# EAGLE design DINCONTROLLER (EAGLE 9.0.0)
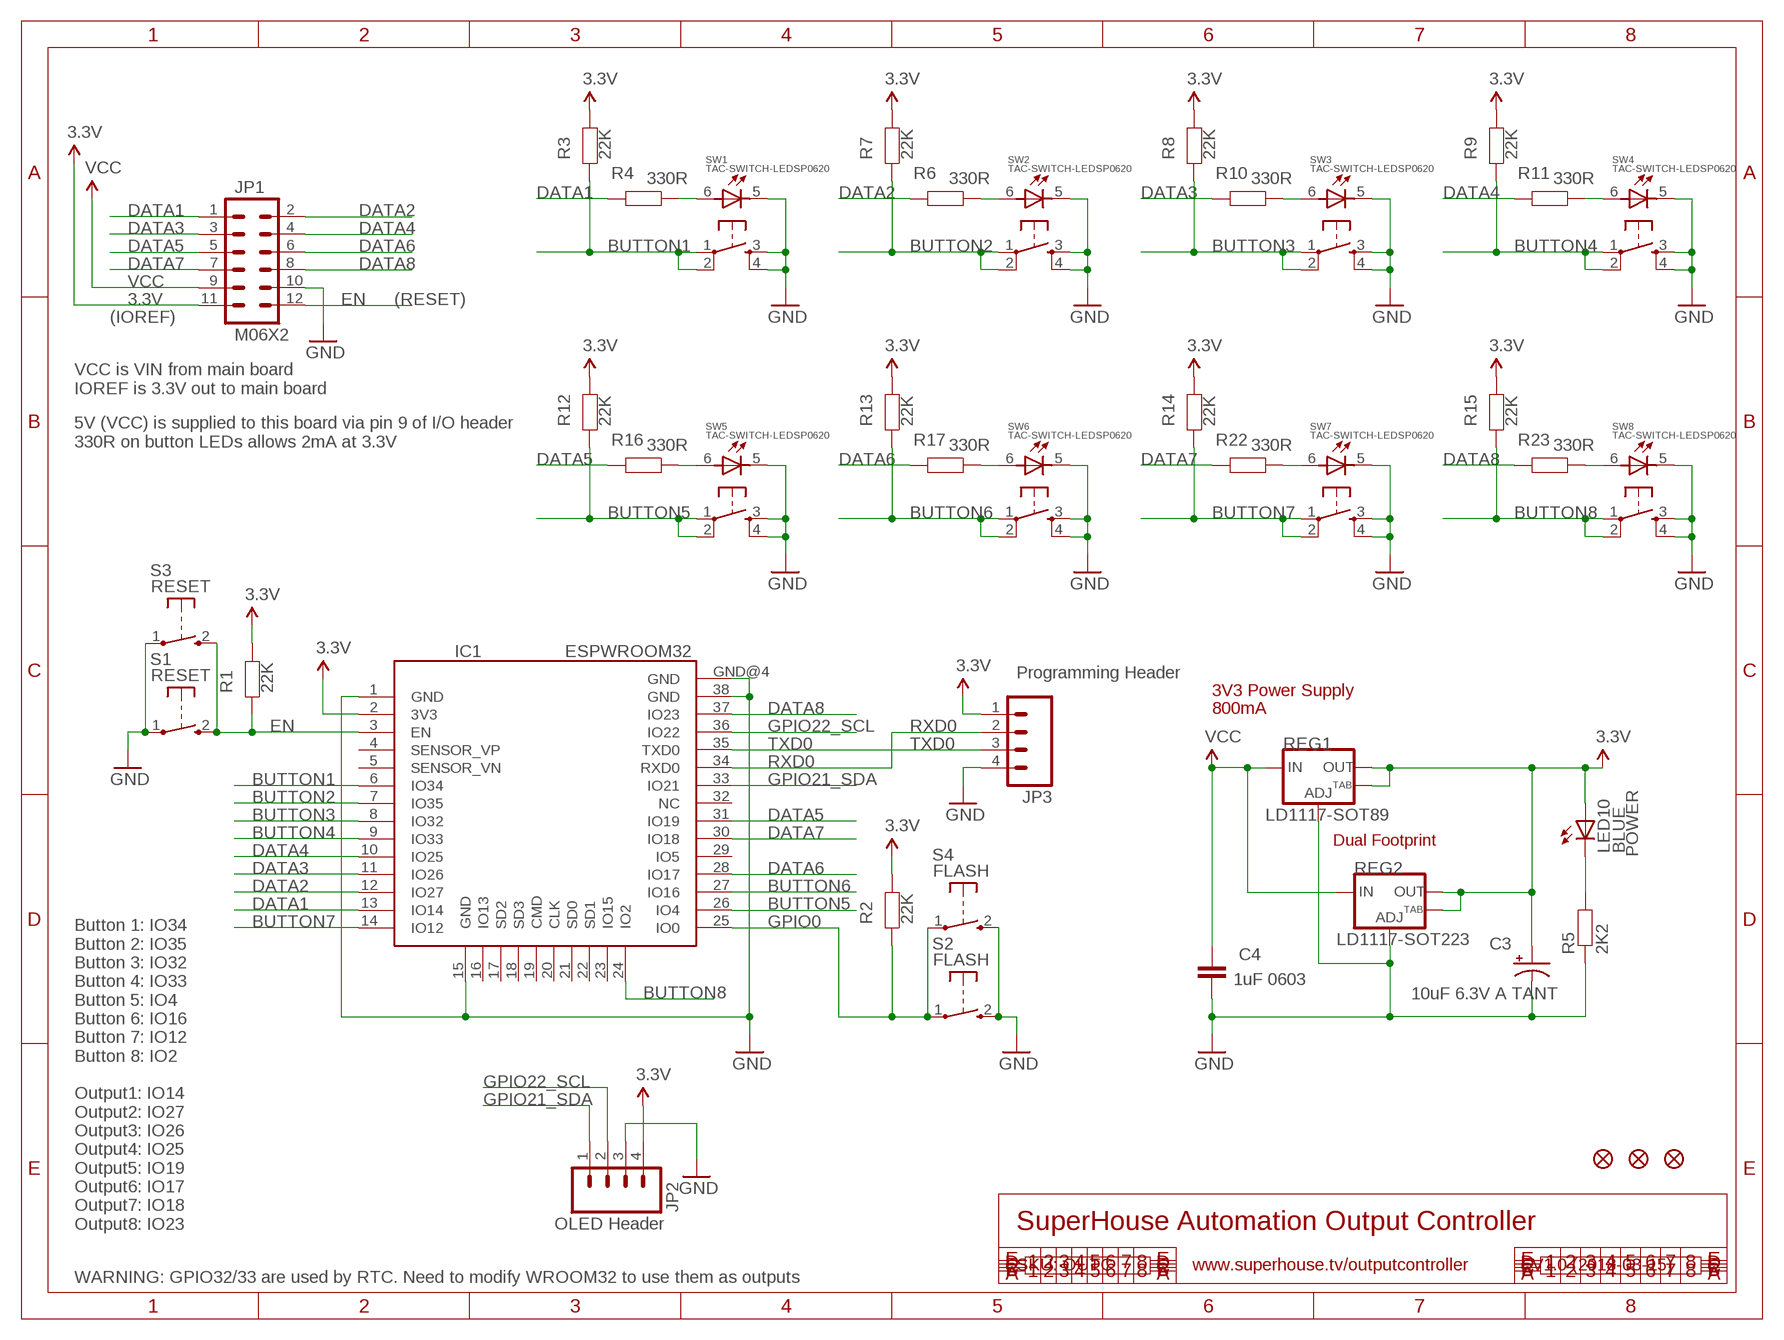
[diagram p0: schematic, sheet 1]

## Parts
C3  10uF 6.3V A TANT  CAP_POL1206  [EIA3216]
C4  1uF 0603  CAP0603  [0603]
FID1  FIDUCIAL1X2.5  [FIDUCIAL-1X2.5]
FID2  FIDUCIAL1X2.5  [FIDUCIAL-1X2.5]
FID3  FIDUCIAL1X2.5  [FIDUCIAL-1X2.5]
IC1  ESPWROOM32  [ESPWROOM32]
JP1  M06X2  [2X6-SHROUDED]
JP2  M04PTH  [1X04]
JP3  M04PTH  [1X04]
LED10  BLUE  LED3MM  [LED3MM]
R1  22K  RESISTOR0603  [0603@2]
R2  22K  RESISTOR0603  [0603@2]
R3  22K  RESISTOR0603  [0603@2]
R4  330R  RESISTOR0603  [0603@2]
R5  2K2  RESISTOR0603  [0603]
R6  330R  RESISTOR0603  [0603@2]
R7  22K  RESISTOR0603  [0603@2]
R8  22K  RESISTOR0603  [0603@2]
R9  22K  RESISTOR0603  [0603@2]
R10  330R  RESISTOR0603  [0603@2]
R11  330R  RESISTOR0603  [0603@2]
R12  22K  RESISTOR0603  [0603@2]
R13  22K  RESISTOR0603  [0603@2]
R14  22K  RESISTOR0603  [0603@2]
R15  22K  RESISTOR0603  [0603@2]
R16  330R  RESISTOR0603  [0603@2]
R17  330R  RESISTOR0603  [0603@2]
R22  330R  RESISTOR0603  [0603@2]
R23  330R  RESISTOR0603  [0603@2]
REG1  LD1117-SOT89  V_REG_LM1117SOT89  [SOT89]
REG2  LD1117-SOT223  V_REG_LM1117SOT223  [SOT223]
S1  RESET  TAC_SWITCH_2PINSMT  [TACTILE_SWITCH_SMD_2PIN_TINY]
S2  FLASH  TAC_SWITCH_2PINSMT  [TACTILE_SWITCH_SMD_2PIN_TINY]
S3  RESET  TAC_SWITCH_2PINSMT  [TACTILE_SWITCH_SMD_2PIN_TINY]
S4  FLASH  TAC_SWITCH_2PINSMT  [TACTILE_SWITCH_SMD_2PIN_TINY]
SW1  TAC-SWITCH-LEDSP0620  [TACTILE-PTH-SP0620]
SW2  TAC-SWITCH-LEDSP0620  [TACTILE-PTH-SP0620]
SW3  TAC-SWITCH-LEDSP0620  [TACTILE-PTH-SP0620]
SW4  TAC-SWITCH-LEDSP0620  [TACTILE-PTH-SP0620]
SW5  TAC-SWITCH-LEDSP0620  [TACTILE-PTH-SP0620]
SW6  TAC-SWITCH-LEDSP0620  [TACTILE-PTH-SP0620]
SW7  TAC-SWITCH-LEDSP0620  [TACTILE-PTH-SP0620]
SW8  TAC-SWITCH-LEDSP0620  [TACTILE-PTH-SP0620]

## Nets
3.3V: C3.A(+) IC1.2(3V3) JP1.11 JP2.4 JP3.1 LED10.A R1.1 R2.1 R3.1 R7.1 R8.1 R9.1 R12.1 R13.1 R14.1 R15.1 REG1.2(OUT) REG1.4(OUT) REG2.2(OUT) REG2.4(OUT)
BUTTON1: IC1.6(IO34) R3.2 SW1.1 SW1.2
BUTTON2: IC1.7(IO35) R7.2 SW2.1 SW2.2
BUTTON3: IC1.8(IO32) R8.2 SW3.1 SW3.2
BUTTON4: IC1.9(IO33) R9.2 SW4.1 SW4.2
BUTTON5: IC1.26(IO4) R12.2 SW5.1 SW5.2
BUTTON6: IC1.27(IO16) R13.2 SW6.1 SW6.2
BUTTON7: IC1.14(IO12) R14.2 SW7.1 SW7.2
BUTTON8: IC1.24(IO2) R15.2 SW8.1 SW8.2
DATA1: IC1.13(IO14) JP1.1 R4.2
DATA2: IC1.12(IO27) JP1.2 R6.2
DATA3: IC1.11(IO26) JP1.3 R10.2
DATA4: IC1.10(IO25) JP1.4 R11.2
DATA5: IC1.31(IO19) JP1.5 R16.2
DATA6: IC1.28(IO17) JP1.6 R17.2
DATA7: IC1.30(IO18) JP1.7 R22.2
DATA8: IC1.37(IO23) JP1.8 R23.2
EN: IC1.3(EN) JP1.12 R1.2 S1.2(S) S3.2(S)
GND: C3.C(-) C4.2 IC1.1(GND) IC1.15(GND) IC1.38(GND) IC1.GND@4(GND) JP1.10 JP2.3 JP3.4 R5.1 REG1.1(ADJ) REG2.1(ADJ) S1.1(P) S2.2(S) S3.1(P) S4.2(S) SW1.3 SW1.4 SW1.5(C) SW2.3 SW2.4 SW2.5(C) SW3.3 SW3.4 SW3.5(C) SW4.3 SW4.4 SW4.5(C) SW5.3 SW5.4 SW5.5(C) SW6.3 SW6.4 SW6.5(C) SW7.3 SW7.4 SW7.5(C) SW8.3 SW8.4 SW8.5(C)
GPIO0: IC1.25(IO0) R2.2 S2.1(P) S4.1(P)
GPIO21_SDA: IC1.33(IO21) JP2.1
GPIO22_SCL: IC1.36(IO22) JP2.2
N$1: R4.1 SW1.6(A)
N$2: R11.1 SW4.6(A)
N$6: R6.1 SW2.6(A)
N$13: R10.1 SW3.6(A)
N$14: LED10.K(C) R5.2
N$17: R16.1 SW5.6(A)
N$18: R17.1 SW6.6(A)
N$23: R22.1 SW7.6(A)
N$24: R23.1 SW8.6(A)
RXD0: IC1.34(RXD0) JP3.2
TXD0: IC1.35(TXD0) JP3.3
VCC: C4.1 JP1.9 REG1.3(IN) REG2.3(IN)
Unconnected: IC1.4(SENSOR_VP) IC1.5(SENSOR_VN) IC1.16(IO13) IC1.17(SD2) IC1.18(SD3) IC1.19(CMD) IC1.20(CLK) IC1.21(SD0) IC1.22(SD1) IC1.23(IO15) IC1.29(IO5) IC1.32(NC)

## Notes on the sheet
- (RESET)
- (IOREF)
- VCC is VIN from main board
  IOREF is 3.3V out to main board
- 5V (VCC) is supplied to this board via pin 9 of I/O header
  330R on button LEDs allows 2mA at 3.3V
- Programming Header
- 3V3 Power Supply
- 800mA
- Dual Footprint
- POWER
- Button 1: IO34
  Button 2: IO35
  Button 3: IO32
  Button 4: IO33
  Button 5: IO4
  Button 6: IO16
  Button 7: IO12
  Button 8: IO2
  
  Output1: IO14
  Output2: IO27
  Output3: IO26
  Output4: IO25
  Output5: IO19
  Output6: IO17
  Output7: IO18
  Output8: IO23
- OLED Header | SuperHouse Automation Output Controller
- SKU: OUTC | www.superhouse.tv/outputcontroller | V1.0 (2018-03-15)
- WARNING: GPIO32/33 are used by RTC. Need to modify WROOM32 to use them as outputs

## Library data of the parts
C3 = freetronics:CAP_POL: Capacitor Polarized These are standard SMD and PTH capacitors. Normally 10uF, 47uF, and 100uF in electrolytic and tantalum varieties. Always verify the external diameter of the through hole cap, it varies with capacity, voltage, and manufacturer. The EIA devices should be standard.
C4 = freetronics:CAP: Capacitor Standard 0603 ceramic capacitor, and 0.1" leaded capacitor.
FID1-FID3 = freetronics:FIDUCIAL: Fiducial Alignment Points Various fiducial points for machine vision alignment.
IC1 = freetronics-jon:ESPWROOM32
JP1 = freetronics-jon:M06X2
JP2 JP3 = freetronics-jon:M04: Header 4 Standard 4-pin 0.1" header. Use with straight break away headers (SKU : PRT-00116), right angle break away headers (PRT-00553), swiss pins (PRT-00743), machine pins (PRT-00117), and female headers (PRT-00115). Molex polarized connector foot print use with SKU : PRT-08231 with associated crimp pins and housings. 1MM SMD Version SKU: PRT-10208
LED10 = freetronics-jon:LED: LEDs Standard schematic elements and footprints for 5mm, 3mm, 1206, and 0603 sized LEDs. 5mm - Spark Fun Electronics SKU : COM-00529 (and others)
R1-R4 R6-R17 R22 R23 = freetronics:RESISTOR: Resistor Basic schematic elements and footprints for 0603, 1206, and PTH 1/10th watt (small) resistors.
R5 = freetronics-jon:RESISTOR: Resistor Basic schematic elements and footprints for 0603, 1206, and PTH 1/10th watt (small) resistors.
REG1 REG2 = freetronics:V_REG_LM1117: Voltage Regulator LD1117 Adjustable low-dropout voltage regulator available in SOT89 and SOT223 SMT packages.
S1-S4 = freetronics-jon:TAC_SWITCH_2PIN: Momentary Tactile Switch - 2 pin
SW1-SW8 = freetronics-jon:TAC-SWITCH-LED: Tactile button with LED illumination

## Net classes
0 Default: width 0.203 mm
1 VCC: width 0.305 mm

## Board
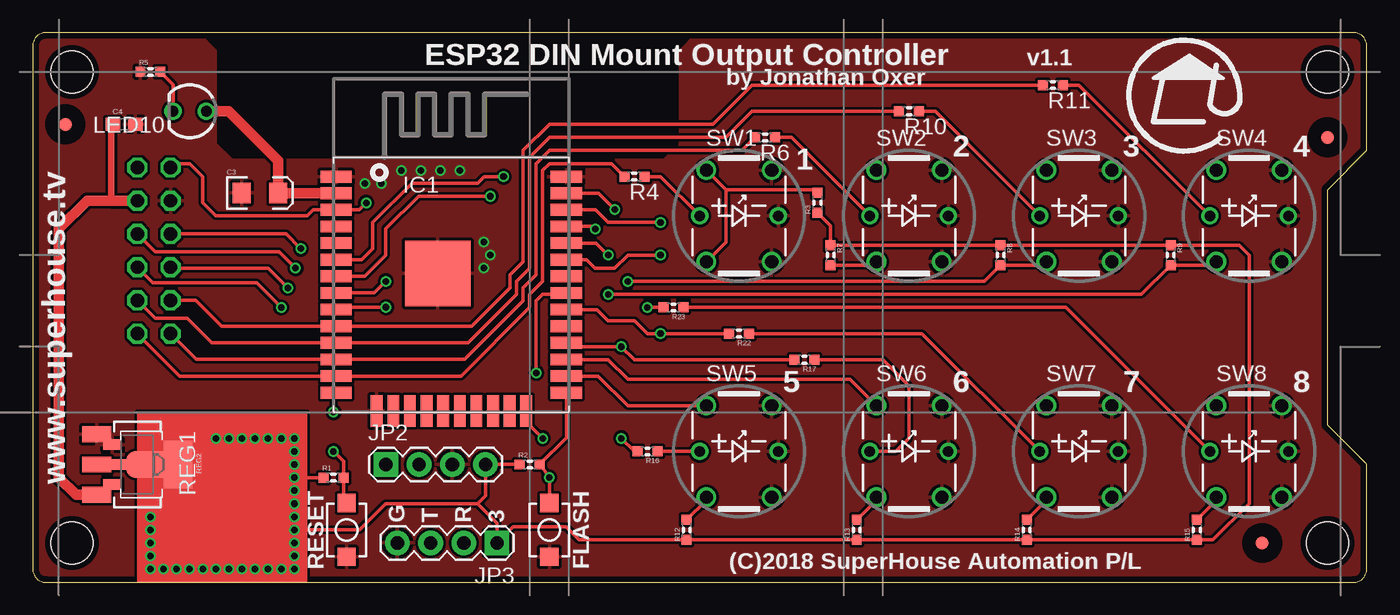
[diagram p1: board, top side]
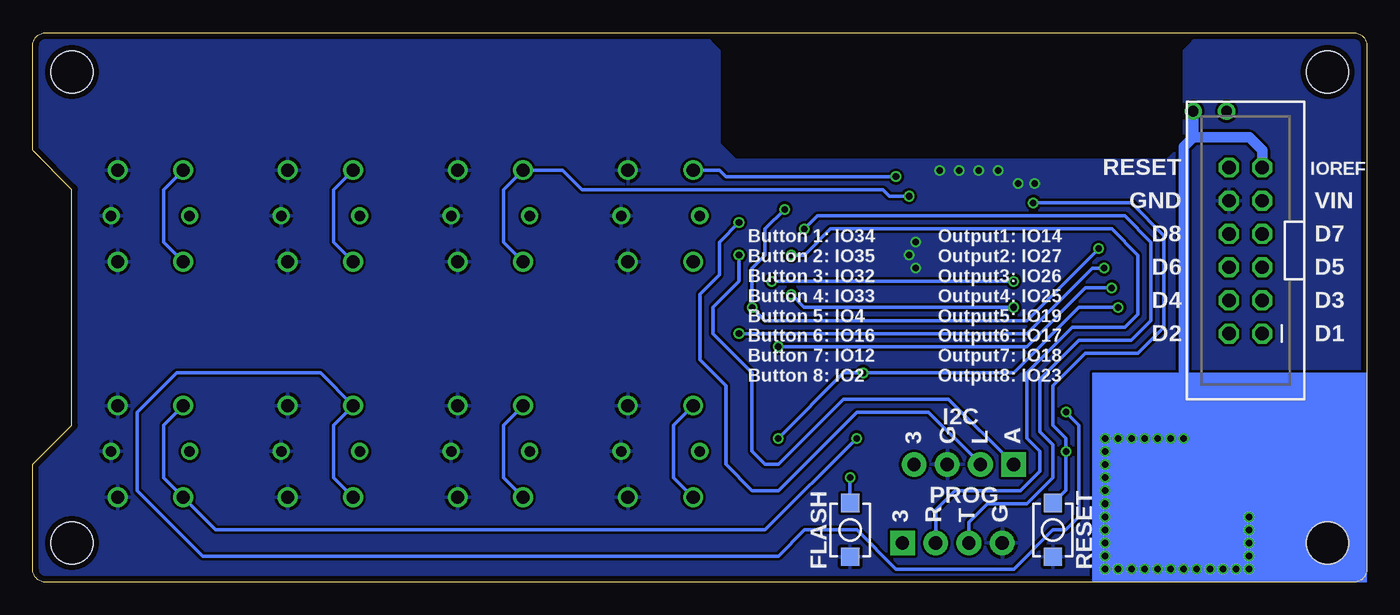
[diagram p2: board, bottom side, seen from below]

Size 102 x 42 mm. Coordinates in mm from the lower left corner, seen from the top.
Outline: 101,42 1,42 arc90 0,41 0,1 arc90 1,0 101,0 arc90 102,1 102,9 99,12 99,30 102,33 102,41 arc90 101,42
Copper layers (1*16): Top 0.035mm / dielectric 1.5mm / Bottom 0.035mm
Design rules "default": minimum track width 8mil, minimum drill 15mil, track to track 8mil, track to pad 8mil, pad to pad 8mil, via to via 8mil, smd to smd 8mil, copper to edge 18mil, drill to drill 8mil, minimum pad ring 10mil, minimum via ring 6mil, stop-mask expansion 4mil, vias tented up to drill 25mil, thermal gap 10mil
Holes 3.2 mm at 3,3 3,39 99,3 99,39
tRestrict: area 93,2 to 95,4; area 1.5,34 to 3.5,36; area 98,33 to 100,35

### Footprints (pad centres in the part's own frame; a part is rotated, then mirrored left to right if it is on the bottom)
EIA3216 = smd 1.4 x 1.6: A 1.4,0; C -1.4,0
0603 = smd 1.1 x 1: 1 -0.85,0; 2 0.85,0
FIDUCIAL-1X2.5 = smd 1 x 1: 1 0,0
ESPWROOM32 = smd 2.4 x 0.9: 1 -8.8,-1.5; 2 -8.8,-2.77; 3 -8.8,-4.04; 4 -8.8,-5.31; 5 -8.8,-6.58; 6 -8.8,-7.85; 7 -8.8,-9.12; 8 -8.8,-10.39; 9 -8.8,-11.66; 10 -8.8,-12.93; 11 -8.8,-14.2; 12 -8.8,-15.47; 13 -8.8,-16.74; 14 -8.8,-18.01; 25 8.8,-18.01; 26 8.8,-16.74; 27 8.8,-15.47; 28 8.8,-14.2; 29 8.8,-12.93; 30 8.8,-11.66; 31 8.8,-10.39; 32 8.8,-9.12; 33 8.8,-7.85; 34 8.8,-6.58; 35 8.8,-5.31; 36 8.8,-4.04; 37 8.8,-2.77; 38 8.8,-1.5 | smd 0.9 x 2.4: 15 -5.7,-19.4; 16 -4.43,-19.4; 17 -3.16,-19.4; 18 -1.89,-19.4; 19 -0.62,-19.4; 20 0.65,-19.4; 21 1.92,-19.4; 22 3.19,-19.4; 23 4.46,-19.4; 24 5.73,-19.4 | smd 5 x 5: GND@4 -1.03,-8.89
2X6-SHROUDED = drill 1.016 octagon: 1 0,0; 2 2.54,0; 3 0,-2.54; 4 2.54,-2.54; 5 0,-5.08; 6 2.54,-5.08; 7 0,-7.62; 8 2.54,-7.62; 9 0,-10.16; 10 2.54,-10.16; 11 0,-12.7; 12 2.54,-12.7
1X04 = drill 1.016 pad 1.88 square: 1 0,0 | drill 1.016 pad 1.88: 2 2.54,0; 3 5.08,0; 4 7.62,0
LED3MM = drill 0.813: A -1.27,0; K 1.27,0
0603@2 = smd 0.762 x 0.762: 1 -0.762,0; 2 0.762,0
0603' = smd 0.762 x 0.762: 1 -0.762,0; 2 0.762,0
SOT89 = smd 0.8 x 1.4: 1 -1.524,-1.905; 3 1.524,-1.905 | smd 0.8 x 1.9: 2 0,-1.651 | smd 2.032 x 3.65: 4 0,0.94
SOT223 = smd 1.219 x 2.235: 1 -2.311,-3.099; 2 0,-3.099; 3 2.311,-3.099 | smd 3.6 x 2.2: 4 0,3.099
TACTILE_SWITCH_SMD_2PIN_TINY = smd 1.4 x 1.4: 1 -2.05,0; 2 2.05,0
TACTILE-PTH-SP0620 = drill 1: 1 -2.5,-3.5; 2 -2.5,3.5; 3 2.5,-3.5; 4 2.5,3.5 | drill 0.8: 5 3,0; 6 -3,0

### Placement (x,y rotation side)
C3  17.37,29.75 0 top
C4  7,35 0 top
FID1  94,3 180 top
FID2  2.5,35 180 top
FID3  99,34 180 top
IC1  32,32.5 0 top
JP1  8,19 180 bottom
JP2  27,9 0 top
JP3  35.5,3 180 top
LED10  12,36 180 top
R1  23,8 0 top
R2  38,9 0 top
R3  60,29 90 top
R4  46,31 180 top
R5  2K2  [0603']  9,39 0 top
R6  56,34 180 top
R7  61,25 270 top
R8  74,25 270 top
R9  87,25 270 top
R10  67,36 180 top
R11  78,38 180 top
R12  50,4 90 top
R13  63,4 90 top
R14  76,4 90 top
R15  89,4 90 top
R16  47,10 180 top
R17  59,17 180 top
R22  54,19 180 top
R23  49,21 180 top
REG1  8,9 270 top
REG2  8,9 270 top
S1  24,4 90 top
S2  39.5,4 270 top
S3  24,4 90 bottom
S4  39.5,4 270 bottom
SW1  54,28 0 top
SW2  67,28 0 top
SW3  80,28 0 top
SW4  93,28 0 top
SW5  54,10 0 top
SW6  67,10 0 top
SW7  80,10 0 top
SW8  93,10 0 top

### Tracks (layer width: path | path; a pad name or v marks a point on that pad's centre or on a via)
3.3V  (via drill 0.5)
  Top 0.254: v20,2 20.33,2 | v20,2 18.1,2 REG2.4 | v14,11 13.1,11 REG2.4 | REG2.2 REG1.2 REG1.4 REG2.4 | v19,11 18,10 | v9,1 v10,1 v11,1 | v20,6 v20,5 | v19,1 v20,2 | v15,1 v16,1 | R1.1 v20,8 | R3.1 61,27.24 R7.1 R8.1 R9.1 92.24,25.76 93,25 93,6 90.24,3.24 R15.1 R14.1 R13.1 R12.1 41.76,3.24 40.76,4.24 36.74,4.24 JP3.1 35.5,4.5 34,6 | R2.1 JP2.4 34.62,6.62 34,6 | 34,6 27,6 25,4 v20,4
  Top 0.508: v14,11 v15,11 v16,11 v17,11 v18,11 v19,11 v20,11 | v9,1 v9,2 v9,3 | v9,3 v9,4 v9,5 v9,3 | v11,1 v12,1 v13,1 | v13,1 v14,1 v15,1 v13,1 | v16,1 v17,1 v18,1 v19,1 v20,1 | v20,2 v20,3 v20,4 v20,5 | v20,6 v20,7 v20,8 | v20,8 v20,9 v20,10 v20,8
  Top 0.813: LED10.A 15,36 18.77,32.23 C3.A 19.09,29.43 19.39,29.73 IC1.2
  Bottom 0.813: JP1.11 8,33 9,34 13.27,34 | 13.27,34 LED10.A | 13.27,34 14,33.27 v14,11
BUTTON1  (via drill 0.5)
  Top 0.254: IC1.6 25.15,24.65 26,25.5 26,27.5 29,30.5 34,30.5 34.5,31 v36,31 | SW1.2 53,30 | 53,30 53,26 SW1.1 | R3.2 59.76,30 53,30
  Bottom 0.254: SW1.2 49.5,31.5 49,31 v36,31
BUTTON2  (via drill 0.5)
  Top 0.254: IC1.7 25.38,23.38 27,25 27,27 29.5,29.5 v35,29.5 | R7.2 64.24,24.24 SW2.1
  Bottom 0.254: SW2.1 66,26 66,30 SW2.2 61.5,31.5 60,30 37,30 36.5,29.5 v35,29.5
BUTTON3  (via drill 0.5)
  Top 0.254: IC1.8 26.11,22.11 v27,23 | R8.2 72.76,23 v45.5,23 | 74.06,24.3 R8.2 | R8.2 77.24,24.24 SW3.1
  Bottom 0.254: SW3.1 79,26 79,30 SW3.2 | v45.5,23 v27,23
BUTTON4  (via drill 0.5)
  Top 0.254: IC1.9 23.36,21 27,21 v27.02,21.02 | v44,22 84.76,22 R9.2 90.24,24.24 SW4.1
  Bottom 0.254: SW4.1 92,26 92,30 SW4.2 | v27.02,21.02 42.98,21.02 | 42.98,21.02 43,21 | v44,22 43.02,21.02 42.98,21.02
BUTTON5
  Top 0.254: R12.2 51.5,6.26 SW5.1 | SW5.2 45.5,13.5 43.24,15.76 IC1.26
  Bottom 0.254: SW5.1 53,8 53,12 SW5.2
BUTTON6
  Top 0.254: IC1.27 40.83,17 44,17 45.5,15.5 62.5,15.5 SW6.2 | R13.2 64.5,6.26 SW6.1
  Bottom 0.254: SW6.1 66,8 66,12 SW6.2
BUTTON7  (via drill 0.5)
  Top 0.254: R14.2 77.5,6.26 SW7.1 | IC1.14 23,14.29 v23,13
  Bottom 0.254: SW7.1 79,8 79,12 SW7.2 80,16 91,16 94,13 94,7 89,2 45,2 43,4 39,4 36,1 27,1 24,4 23,4 22,5 22,12 v23,13
BUTTON8  (via drill 0.5)
  Top 0.254: R15.2 90.5,6.26 SW8.1 | v39,11 37.73,12.27 IC1.24
  Bottom 0.254: SW8.2 92,12 92,8 SW8.1 88,4 46,4 v39,11
DATA1
  Top 0.254: R4.2 44.24,32 39.5,32 39,31.5 39,23 38,22 38,21 32.76,15.76 IC1.13 11.24,15.76 JP1.1
DATA2
  Top 0.254: JP1.2 12.51,17.03 IC1.12 33.03,17.03 37.5,21.5 37.5,22.5 38.5,23.5 38.5,32 39.5,33 54.24,33 R6.2
DATA3
  Top 0.254: JP1.3 9.35,20.19 11.81,20.19 13.7,18.3 IC1.11 33.3,18.3 37,22 37,23 38,24 38,32.5 39.5,34 53,34 55,36 R10.2
DATA4
  Top 0.254: JP1.4 12.46,21.54 14.43,19.57 IC1.10 33.57,19.57 36.5,22.5 36.5,23.5 37.5,24.5 37.5,33 39.5,35 52,35 55,38 R11.2
DATA5  (via drill 0.5)
  Top 0.254: JP1.5 9.19,22.89 11,22.89 11.39,22.89 17.11,22.89 v19,21 | 40.91,22 IC1.31 40.69,22 39,22 38.5,21.5 v38.5,16 | v45,11 46,10 R16.2
  Bottom 0.254: v19,21 22,21 27,16 v38.5,16 40,16 v45,11
DATA6  (via drill 0.5)
  Top 0.254: JP1.6 10.62,24 18,24 v19.5,22.5 | R17.2 46,17 v45,18 41.1,18 IC1.28
  Bottom 0.254: v19.5,22.5 21.5,22.5 26,18 v45,18
DATA7  (via drill 0.5)
  Top 0.254: JP1.7 9.35,25.27 18.83,25.27 v20.1,24 | R22.2 v48,19 47,19 46,20 44,20 43.16,20.84 IC1.30
  Bottom 0.254: v20.1,24 21,24 26,19 v48,19
DATA8  (via drill 0.5)
  Top 0.254: v47,21 R23.2 | v20.5,25.5 19.38,26.62 JP1.8 | v44.5,28.5 43.27,29.73 IC1.37
  Bottom 0.254: v20.5,25.5 26,20 46,20 v47,21 47,24 46,25 46,27 v44.5,28.5
EN  (via drill 0.5)
  Top 0.254: S3.2 23.76,6.29 R1.2 23.76,9.24 v23,10 | v25.5,29 24.96,28.46 IC1.3 21.46,28.46 21,28 14,28 13,29 13,31 12,32 10.84,32 JP1.12
  Bottom 0.254: v25.5,29 18,29 15.5,26.5 15.5,19.5 17.5,17.5 21.5,17.5 24,15 24,12 23,11 v23,10 23,7.05 S3.2
GND  (via drill 0.5)
  other vias: 25.4,30.48 26.67,30.48 34.5,26 35,25 34.5,24 32.67,31.48 31.17,31.48 29.67,31.48 28.17,31.48
  pour Bottom: 101,0 1,0 arc-90 0,1 0,41 arc-90 1,42 1.09,41.91 12.7,41.91 13.97,40.64 13.97,33.52 15.24,32.25 48.26,32.25 49.53,33.52 49.53,40.64 50.8,41.91 101,42 arc-90 102,41 102,33 99,30 99,12 102,9 102,1 arc-90
  pour Top: 101,0 1,0 arc-90 0,1 0,41 arc-90 1,42 1.09,41.91 12.7,41.91 13.97,40.64 13.97,33.52 15.24,32.25 48.26,32.25 49.53,33.52 49.53,40.64 50.8,41.91 101,42 arc-90 102,41 102,33 99,30 99,12 102,9 102,1 arc-90
GPIO0  (via drill 0.5)
  Top 0.254: S4.1 v39.5,8 39,8.76 R2.2 40.8,11.04 IC1.25
  Bottom 0.254: S4.1 v39.5,8
GPIO21_SDA  (via drill 0.5)
  Top 0.254: v48,25 45.5,25 44.5,24 43,24 42.35,24.65 IC1.33
  Bottom 0.254: JP2.1 32,14 40,14 45,9 46,9 47,10 47,16 50,19 50,21 48,23 v48,25
GPIO22_SCL  (via drill 0.5)
  Top 0.254: v48,27.5 44,27.5 43.04,28.46 IC1.36
  Bottom 0.254: JP2.2 29.54,9.04 33.5,13 39,13 45,7 47,7 49,9 49,15 51,17 51,22 49.5,23.5 49.5,26 v48,27.5
N$1
  Top 0.254: R4.1 48,31 SW1.6
N$2
  Top 0.254: R11.1 80,38 SW4.6
N$6
  Top 0.254: R6.1 58,34 SW2.6
N$13
  Top 0.254: SW3.6 69,36 R10.1
N$14
  Top 0.254: R5.2 10.73,38.03 LED10.K
N$17
  Top 0.254: R16.1 SW5.6
N$18
  Top 0.254: SW6.6 66,10 67,11 67,15 65,17 R17.1
N$23
  Top 0.254: R22.1 68,19 SW7.6
N$24
  Top 0.254: R23.1 79,21 SW8.6
RXD0  (via drill 0.5)
  Top 0.254: IC1.34 43.08,25.92 v44,25
  Bottom 0.254: v44,25 43,25 41,27 19.5,27 17.5,25 17.5,20.5 18.5,19.5 22.5,19.5 26,16 26,11 25,10 25,8.5 26.5,7 31.5,7 32.96,5.54 JP3.2
TXD0  (via drill 0.5)
  Top 0.254: IC1.35 42.81,27.19 v43,27
  Bottom 0.254: v43,27 42,28 18.5,28 16.5,26 16.5,20 18,18.5 22,18.5 25,15.5 25,11.5 24,10.5 24,8 26,6 29,6 30.42,4.58 JP3.3
VCC
  Top 0.254: REG2.3 5.69,7.48 REG1.3
  Top 0.508: C4.1 6,34.85 6,29.16
  Top 0.813: REG2.3 3.31,6.69 2,8 2,27 4.16,29.16 6,29.16 JP1.9
(copper drawn outside any net)
  shapes: Bottom area x1, Top area x1

### Text on the board
tPlace: ESP32 DIN Mount Output Controller | v1.1 | by Jonathan Oxer | 1 | 2 | 3 | 4 | 5 | 6 | 7 | 8 | www.superhouse.tv | G | T | R | 3 | RESET | FLASH | (C)2018 SuperHouse Automation P/L
bPlace: IOREF | RESET | VIN | GND | D7 | D8 | D5 | D6 | D3 | D4 | D1 | D2 | Output1: IO14 / Output2: IO27 / Output3: IO26 / Output4: IO25 / Output5: IO19 / Output6: IO17 / Output7: IO18 / Output8: IO23 | Button 1: IO34 / Button 2: IO35 / Button 3: IO32 / Button 4: IO33 / Button 5: IO4 / Button 6: IO16 / Button 7: IO12 / Button 8: IO2 | I2C | A | L | G | 3 | PROG | G | T | R | 3 | RESET | FLASH